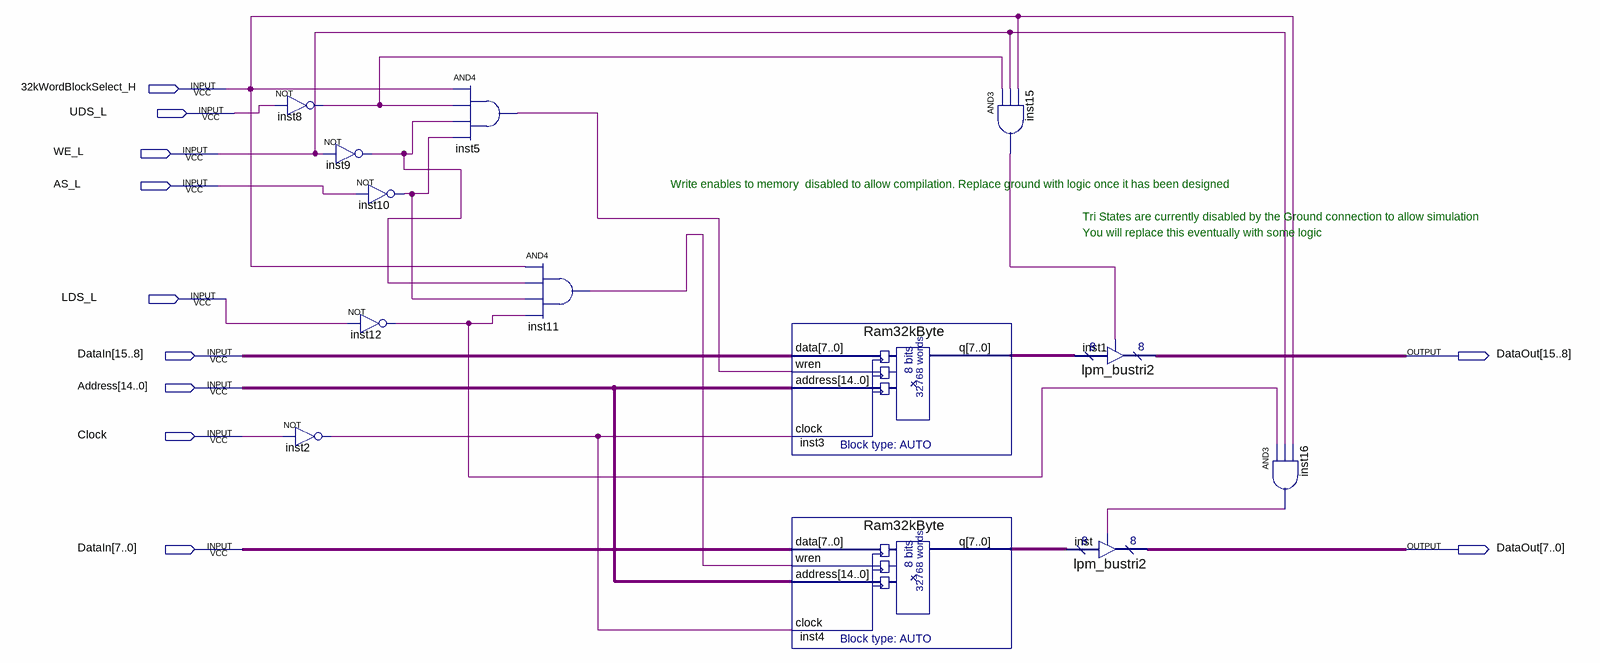
[diagram p0: schematic sheet]
// Quartus schematic SramBlock_32KWord.bdf as structural Verilog: 13 symbols, 11 pins
module SramBlock_32KWord (
  input  \32kWordBlockSelect_H ,
  input  UDS_L,
  input  WE_L,
  input  AS_L,
  input  LDS_L,
  input  [15:0] DataIn,
  input  [14:0] Address,
  input  Clock,
  output [15:0] DataOut
);

  wire inst2_out, inst5_out, inst8_out, inst9_out, inst10_out, inst11_out, inst12_out, inst15_out, inst16_out;
  wire [7:0] inst3_q, inst4_q;

  not inst8 (inst8_out, UDS_L);
  not inst2 (inst2_out, Clock);
  not inst9 (inst9_out, WE_L);
  not inst10 (inst10_out, AS_L);
  not inst12 (inst12_out, LDS_L);
  and inst5 (inst5_out, \32kWordBlockSelect_H , inst8_out, inst9_out, inst10_out);
  and inst11 (inst11_out, \32kWordBlockSelect_H , inst9_out, inst10_out, inst12_out);
  Ram32kByte inst3 (.data(DataIn[15:8]), .wren(inst5_out), .address(Address), .clock(inst2_out), .q(inst3_q));
  Ram32kByte inst4 (.data(DataIn[7:0]), .wren(inst11_out), .address(Address), .clock(inst2_out), .q(inst4_q));
  and inst15 (inst15_out, inst8_out, WE_L, \32kWordBlockSelect_H );
  lpm_bustri2 inst1 (.enabledt(inst15_out), .data(inst3_q), .tridata(DataOut[15:8]));
  lpm_bustri2 inst (.enabledt(inst16_out), .data(inst4_q), .tridata(DataOut[7:0]));
  and inst16 (inst16_out, inst12_out, WE_L, \32kWordBlockSelect_H );

  // Notes on the sheet:
  //   Write enables to memory  disabled to allow compilation. Replace ground with logic once it has been designed
  //   Tri States are currently disabled by the Ground connection to allow simulation
  //   You will replace this eventually with some logic
endmodule
